# EAGLE design audio_spectrum (EAGLE 6.6.0)
AUTHOR: Joshua Adkins; REV: A; TITLE: AUDIO SPECTRUM MODULE

## Sheet 1 of 2
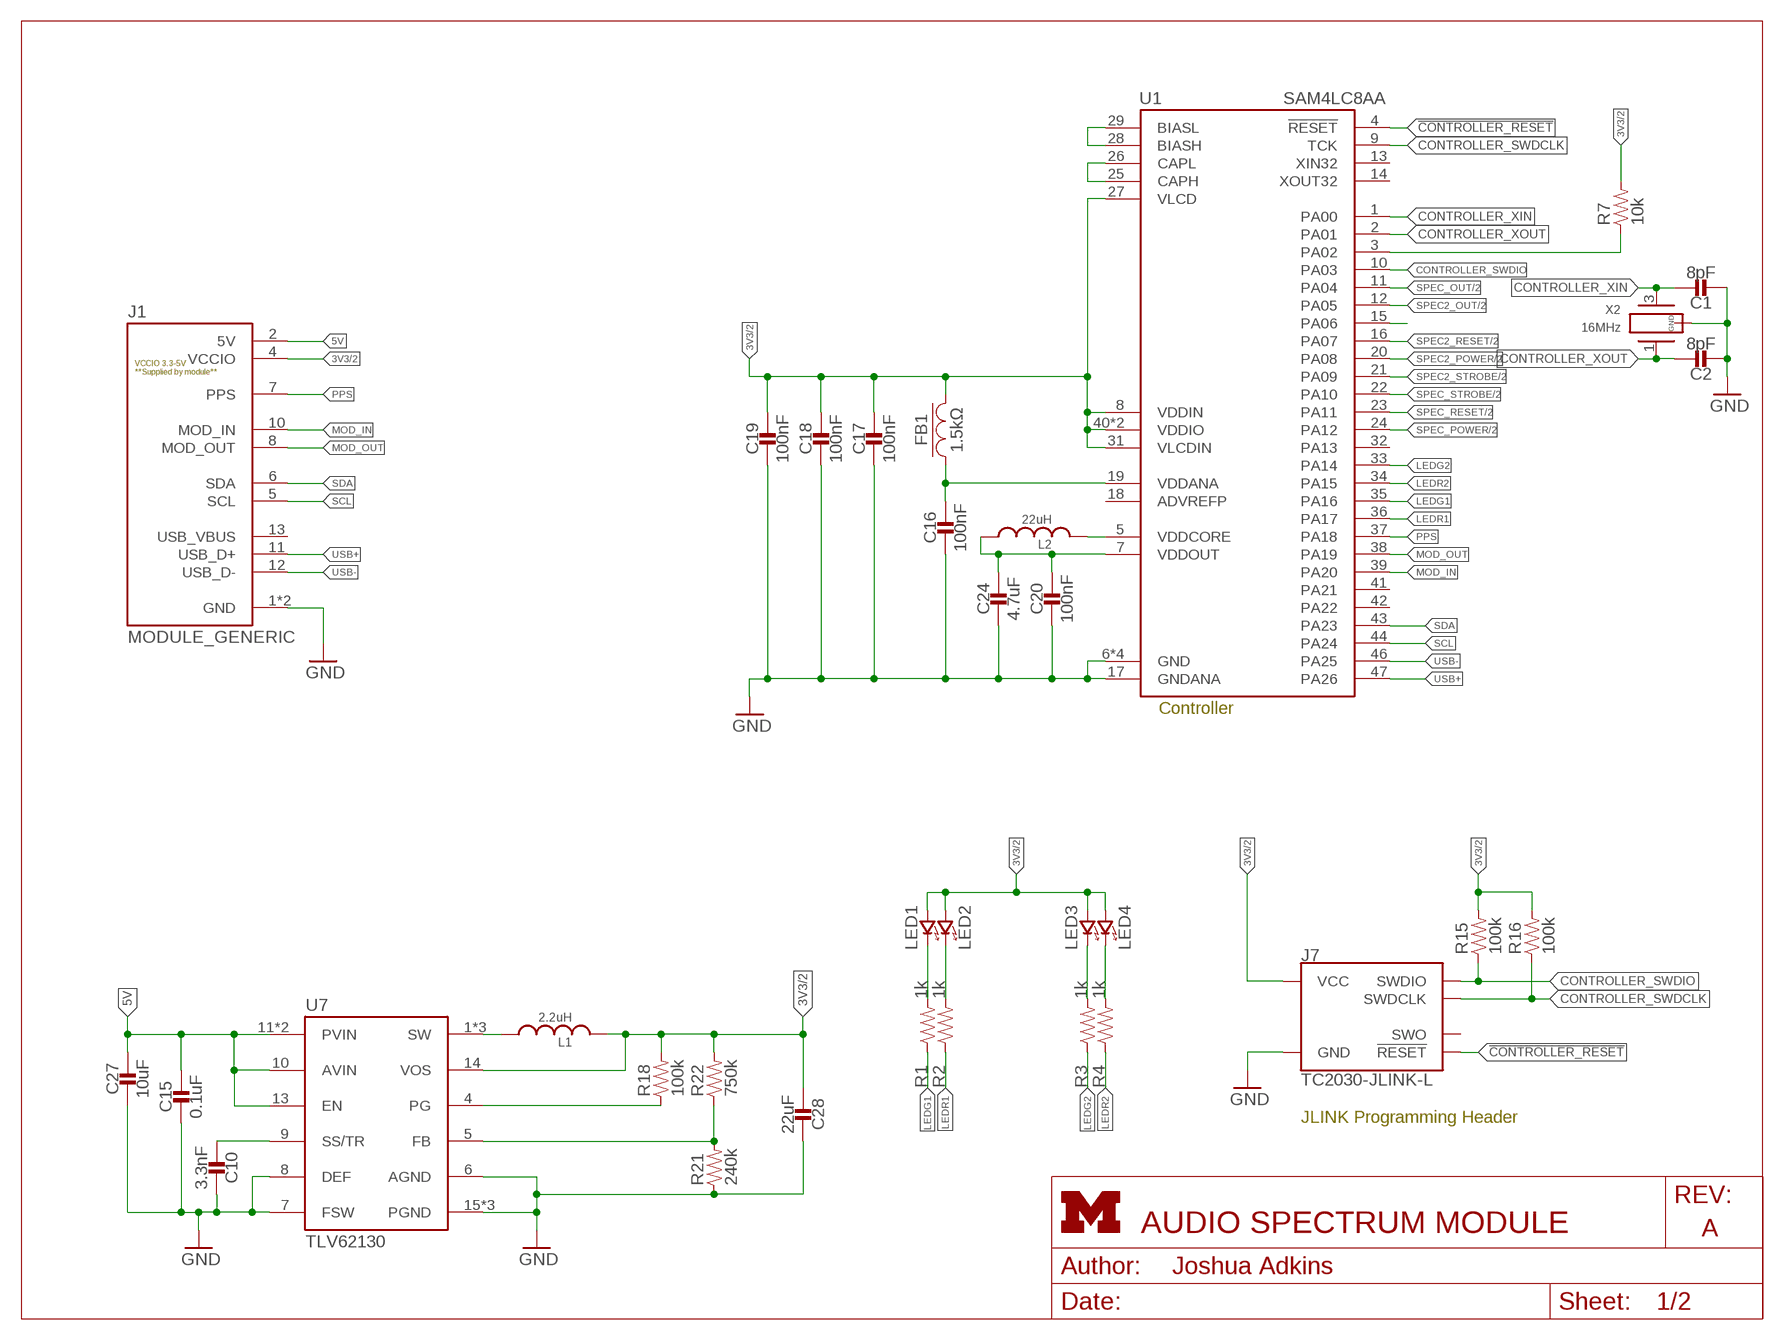
[diagram p0: schematic, sheet 1]
FRAME1 (LETTER_L_UMICH): HEIGHT: 8.5in; WIDTH: 11in

### Parts
C1  8pF  CAPACITOR0603_CAP  [0603_CAP]
C2  8pF  CAPACITOR0603_CAP  [0603_CAP]
C10  3.3nF  CAPACITOR0603_CAP  [0603_CAP]
C15  0.1uF  CAPACITOR0603_CAP  [0603_CAP]
C16  100nF  CAPACITOR0603_CAP  [0603_CAP]
C17  100nF  CAPACITOR0603_CAP  [0603_CAP]
C18  100nF  CAPACITOR0603_CAP  [0603_CAP]
C19  100nF  CAPACITOR0603_CAP  [0603_CAP]
C20  100nF  CAPACITOR0603_CAP  [0603_CAP]
C24  4.7uF  CAPACITOR0603_CAP  [0603_CAP]
C27  10uF  CAPACITOR0603_CAP  [0603_CAP]
C28  22uF  CAPACITOR0603_CAP  [0603_CAP]
FB1  1.5kΩ  FERRITE_BEAD0603  [0603_CAP]
J1  MODULE_GENERIC  [MODULE_GENERIC]
J7  TC2030-JLINK-L  [TC2030-IDC]
L1  2.2uH  INDUCTORIHL  [IHL-1212BZ-11]
L2  22uH  LHQ3NP  [1212]
LED1  LED0603  [LED-0603]
LED2  LED0603  [LED-0603]
LED3  LED0603  [LED-0603]
LED4  LED0603  [LED-0603]
R1  1k  RESISTOR0603_RES  [0603-RES]
R2  1k  RESISTOR0603_RES  [0603-RES]
R3  1k  RESISTOR0603_RES  [0603-RES]
R4  1k  RESISTOR0603_RES  [0603-RES]
R7  10k  RESISTOR0603_RES  [0603-RES]
R15  100k  RESISTOR0603_RES  [0603-RES]
R16  100k  RESISTOR0603_RES  [0603-RES]
R18  100k  RESISTOR0603_RES  [0603-RES]
R21  240k  RESISTOR0603_RES  [0603-RES]
R22  750k  RESISTOR0603_RES  [0603-RES]
U1  SAM4LC8AA  [QFN-48-7MM]
U7  TLV62130  [TQFN-16/3MM]
X2  16MHz  FH1600015  [FHXXX]

### Nets
3V3: C17.1 C18.1 C19.1 C28.2 FB1.2 J1.4(VCCIO) J7.1(VCC) L1.P$2 LED1.A(ANODE) LED2.A(ANODE) LED3.A(ANODE) LED4.A(ANODE) R7.2 R15.2 R16.2 R18.2 R22.2 U1.8(VDDIN) U1.27(VLCD) U1.31(VLCDIN) U1.40(VDDIO) U1.45(VDDIO) U7.14(VOS) ; also sheet 2
3VSWOUT: L1.P$1 U7.1(SW) U7.2(SW) U7.3(SW)
5V: C15.1 C27.1 J1.2(5V) U7.10(AVIN) U7.11(PVIN) U7.12(PVIN) U7.13(EN)
!CONTROLLER_RESET: J7.3(!RESET) U1.4(!RESET)
CONTROLLER_BUCK/LDO_N: R7.1 U1.3(PA02)
CONTROLLER_SWDCLK: J7.4(SWDCLK) R16.1 U1.9(TCK)
CONTROLLER_SWDIO: J7.2(SWDIO) R15.1 U1.10(PA03)
CONTROLLER_XIN: C1.1 U1.1(PA00) X2.3
CONTROLLER_XOUT: C2.1 U1.2(PA01) X2.1
GND: C1.2 C2.2 C10.1 C15.2 C16.2 C17.2 C18.2 C19.2 C20.2 C24.2 C27.2 C28.1 J1.1(GND) J1.14(GND) J7.5(GND) R21.1 U1.6(GND) U1.17(GNDANA) U1.30(GND) U1.48(GND) U1.THERMAL(GND) U7.6(AGND) U7.7(FSW) U7.8(DEF) U7.15(PGND) U7.16(PGND) U7.GND X2.2(GND) X2.4(GND) ; also sheet 2
LEDG1: R1.1 U1.35(PA16)
LEDG2: R3.1 U1.33(PA14)
LEDR1: R2.1 U1.36(PA17)
LEDR2: R4.1 U1.34(PA15)
MOD_IN: J1.10(MOD_IN) U1.39(PA20)
MOD_OUT: J1.8(MOD_OUT) U1.38(PA19)
N$21: LED1.C(CATHODE) R1.2
N$23: LED2.C(CATHODE) R2.2
N$25: LED4.C(CATHODE) R4.2
N$31: U1.15(PA06)
N$32: C16.1 FB1.1 U1.19(VDDANA)
N$33: LED3.C(CATHODE) R3.2
N$34: C10.2 U7.9(SS/TR)
N$36: R18.1 U7.4(PG)
N$37: R21.2 R22.1 U7.5(FB)
N$44: C20.1 C24.1 L2.P$1 U1.7(VDDOUT)
N$52: L2.P$2 U1.5(VDDCORE)
N$53: U1.28(BIASH) U1.29(BIASL)
N$54: U1.25(CAPH) U1.26(CAPL)
PPS: J1.7(PPS) U1.37(PA18)
SCL: J1.5(SCL) U1.44(PA24)
SDA: J1.6(SDA) U1.43(PA23)
SPEC2_OUT: U1.12(PA05) ; also sheet 2
SPEC2_POWER: U1.20(PA08) ; also sheet 2
SPEC2_RESET: U1.16(PA07) ; also sheet 2
SPEC2_STROBE: U1.21(PA09) ; also sheet 2
SPEC_OUT: U1.11(PA04) ; also sheet 2
SPEC_POWER: U1.24(PA12) ; also sheet 2
SPEC_RESET: U1.23(PA11) ; also sheet 2
SPEC_STROBE: U1.22(PA10) ; also sheet 2
USB+: J1.11(USB_D+) U1.47(PA26)
USB-: J1.12(USB_D-) U1.46(PA25)
Unconnected: J1.13(USB_VBUS) J7.6(SWO) U1.13(XIN32) U1.14(XOUT32) U1.18(ADVREFP) U1.32(PA13) U1.41(PA21) U1.42(PA22)

### Notes on the sheet
- Controller
- JLINK Programming Header

## Sheet 2 of 2
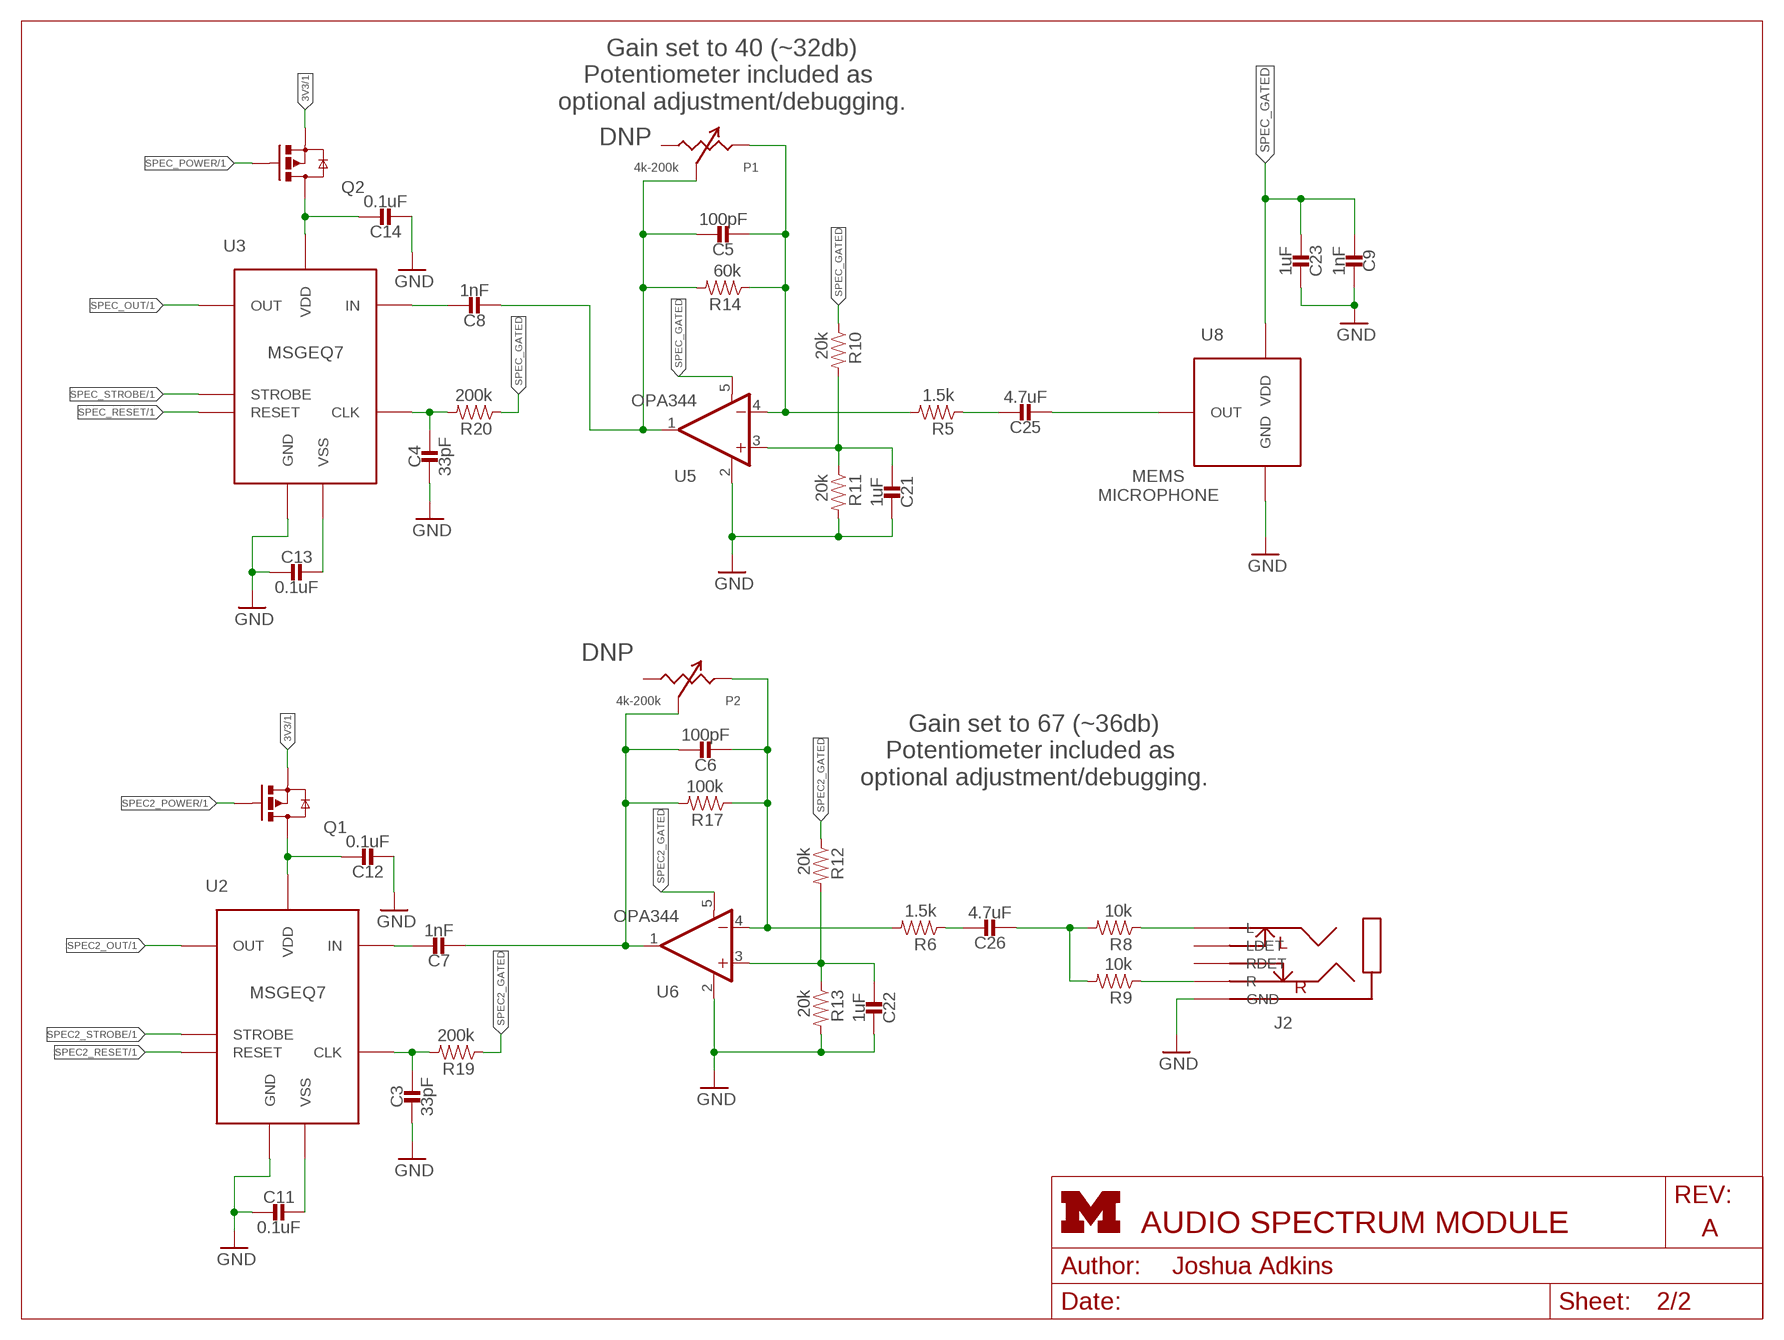
[diagram p1: schematic, sheet 2]
FRAME2 (LETTER_L_UMICH): HEIGHT: 8.5in; WIDTH: 11in

### Parts
C3  33pF  CAPACITOR0603_CAP  [0603_CAP]
C4  33pF  CAPACITOR0603_CAP  [0603_CAP]
C5  100pF  CAPACITOR0603_CAP  [0603_CAP]
C6  100pF  CAPACITOR0603_CAP  [0603_CAP]
C7  1nF  CAPACITOR0603_CAP  [0603_CAP]
C8  1nF  CAPACITOR0603_CAP  [0603_CAP]
C9  1nF  CAPACITOR0603_CAP  [0603_CAP]
C11  0.1uF  CAPACITOR0603_CAP  [0603_CAP]
C12  0.1uF  CAPACITOR0603_CAP  [0603_CAP]
C13  0.1uF  CAPACITOR0603_CAP  [0603_CAP]
C14  0.1uF  CAPACITOR0603_CAP  [0603_CAP]
C21  1uF  CAPACITOR0603_CAP  [0603_CAP]
C22  1uF  CAPACITOR0603_CAP  [0603_CAP]
C23  1uF  CAPACITOR0603_CAP  [0603_CAP]
C25  4.7uF  CAPACITOR0603_CAP  [0603_CAP]
C26  4.7uF  CAPACITOR0603_CAP  [0603_CAP]
J2  AUDIO-JACK-VERTICAL  [AUDIO-JACK-VERTICAL]
P1  4k-200k  POTTC33X  [TC33X-2]
P2  4k-200k  POTTC33X  [TC33X-2]
Q1  NX3008PBK  [SOT23-3]
Q2  NX3008PBK  [SOT23-3]
R5  1.5k  RESISTOR0603_RES  [0603-RES]
R6  1.5k  RESISTOR0603_RES  [0603-RES]
R8  10k  RESISTOR0603_RES  [0603-RES]
R9  10k  RESISTOR0603_RES  [0603-RES]
R10  20k  RESISTOR0603_RES  [0603-RES]
R11  20k  RESISTOR0603_RES  [0603-RES]
R12  20k  RESISTOR0603_RES  [0603-RES]
R13  20k  RESISTOR0603_RES  [0603-RES]
R14  60k  RESISTOR0603_RES  [0603-RES]
R17  100k  RESISTOR0603_RES  [0603-RES]
R19  200k  RESISTOR0603_RES  [0603-RES]
R20  200k  RESISTOR0603_RES  [0603-RES]
U2  MSGEQ7  [DIP-8]
U3  MSGEQ7  [DIP-8]
U5  OPA344  [SOT23-5]
U6  OPA344  [SOT23-5]
U8  MP23AB02B  [MP23AB02B]

### Nets
3V3: Q1.2(S) Q2.2(S) ; also sheet 1
GND: C3.2 C4.2 C9.1 C11.2 C12.2 C13.2 C14.2 C21.1 C22.1 C23.1 J2.5(GND) R11.2 R13.2 U2.6(GND) U3.6(GND) U5.2(V-) U6.2(V-) U8.3(GND) ; also sheet 1
N$1: C11.1 U2.2(VSS)
N$2: C3.1 R19.2 U2.8(CLK)
N$3: C7.1 U2.5(IN)
N$4: C6.1 C7.2 P2.3(W) R17.2 U6.1(OUT)
N$5: C13.1 U3.2(VSS)
N$6: C4.1 R20.2 U3.8(CLK)
N$7: C8.1 U3.5(IN)
N$8: C5.1 C8.2 P1.3(W) R14.2 U5.1(OUT)
N$9: C21.2 R10.2 R11.1 U5.3(+IN)
N$10: C26.2 R8.2 R9.2
N$11: C22.2 R12.2 R13.1 U6.3(+IN)
N$12: C5.2 P1.2(CW) R5.2 R14.1 U5.4(-IN)
N$13: C25.1 R5.1
N$14: C6.2 P2.2(CW) R6.2 R17.1 U6.4(-IN)
N$15: C26.1 R6.1
N$16: J2.1(R) R9.1
N$17: J2.4(L) R8.1
N$18: C25.2 U8.1(OUT)
SPEC2_GATED: C12.1 Q1.3(D) R12.1 R19.1 U2.1(VDD) U6.5(V+)
SPEC2_OUT: U2.3(OUT) ; also sheet 1
SPEC2_POWER: Q1.1(G) ; also sheet 1
SPEC2_RESET: U2.7(RESET) ; also sheet 1
SPEC2_STROBE: U2.4(STROBE) ; also sheet 1
SPEC_GATED: C9.2 C14.1 C23.2 Q2.3(D) R10.1 R20.1 U3.1(VDD) U5.5(V+) U8.2(VDD)
SPEC_OUT: U3.3(OUT) ; also sheet 1
SPEC_POWER: Q2.1(G) ; also sheet 1
SPEC_RESET: U3.7(RESET) ; also sheet 1
SPEC_STROBE: U3.4(STROBE) ; also sheet 1
Unconnected: J2.2(RDET) J2.3(LDET) P1.1(CCW) P2.1(CCW)

### Notes on the sheet
- Gain set to 40 (~32db)
  Potentiometer included as 
  optional adjustment/debugging.
- DNP
- DNP
- Gain set to 67 (~36db)
  Potentiometer included as 
  optional adjustment/debugging.

## Library data of the parts
C1 C2 = passives:CAPACITOR: 0402 Capacitor; DIGIKEY: 490-8230-1-ND
C3-C15 C21-C23 C25-C28 = passives:CAPACITOR: 0402 Capacitor
C16-C20 = passives:CAPACITOR: 0402 Capacitor; DIGIKEY: 490-10777-1-ND
C24 = passives:CAPACITOR: 0402 Capacitor; DIGIKEY: 490-13252-1-ND
FB1 = passives:FERRITE_BEAD; DIGIKEY: 490-5216-1-ND
J1 = signpost:MODULE_GENERIC: Module header and PCB guildes for signposts; DIGIKEY: S9170-ND
J2 = connector:AUDIO-JACK-VERTICAL: A vertical audio jack; MOUSER: 806-STX-3790-5N
J7 = connector:TC2030-JLINK
L1 = passives:INDUCTOR: A very specific inductor; DIGIKEY: 541-1322-1-ND
L2 = signpost:LHQ3NP: LHQ3NP Inductor; DIGIKEY: 490-5350-1-ND
LED1-LED4 = leds:LED: LED
P1 P2 = pots:POT: Potentiometer; DIGIKEY: TC33X-2-204ECT-ND
Q1 Q2 = fets:NX3008PBK: MOSFET - P Channel; DIGIKEY: 568-10499-1-ND; MOUSER: 771-NX3008PBK,215; NEWARK: 74T4665
R1-R4 R7 = passives:RESISTOR: Resistor Basic schematic elements and footprints for 0603, 1206, and PTH resistors.; DIGIKEY: 1276-3431-1-ND
R5 R6 R8-R14 R17-R22 = passives:RESISTOR: Resistor Basic schematic elements and footprints for 0603, 1206, and PTH resistors.
R15 R16 = passives:RESISTOR: Resistor Basic schematic elements and footprints for 0603, 1206, and PTH resistors.; DIGIKEY: 1276-3432-1-ND
U1 = chips:SAM4LC8AA: Atmel SAM4L microcontroller. ARM Cortex M4 with 512 KB Flash and 64 KB RAM; DIGIKEY: ATSAM4LC8AA-MU-ND
U2 U3 = chips:MSGEQ7: A CMOS spectrum analyzer; DIGIKEY: 1568-1335-ND
U5 U6 = SparkFun-AnalogIC:OPA344: Single gate rail-to-rail output op-amp. Inputs extend 300mV past rails.
U7 = chips:TLV62130: High Efficient 3A switching step-down regulator. 1V-5V out, 4V-17V in.; DIGIKEY: 296-35978-1-ND
U8 = chips:MP23AB02B: A pretty normal mems microphone; DIGIKEY: 497-14947-1-ND
X2 = crystals:FH1600015: Pericom Type FH 16 MHz 2.5 x 2.0 mm; DIGIKEY: FH1600015CT-ND

## Board
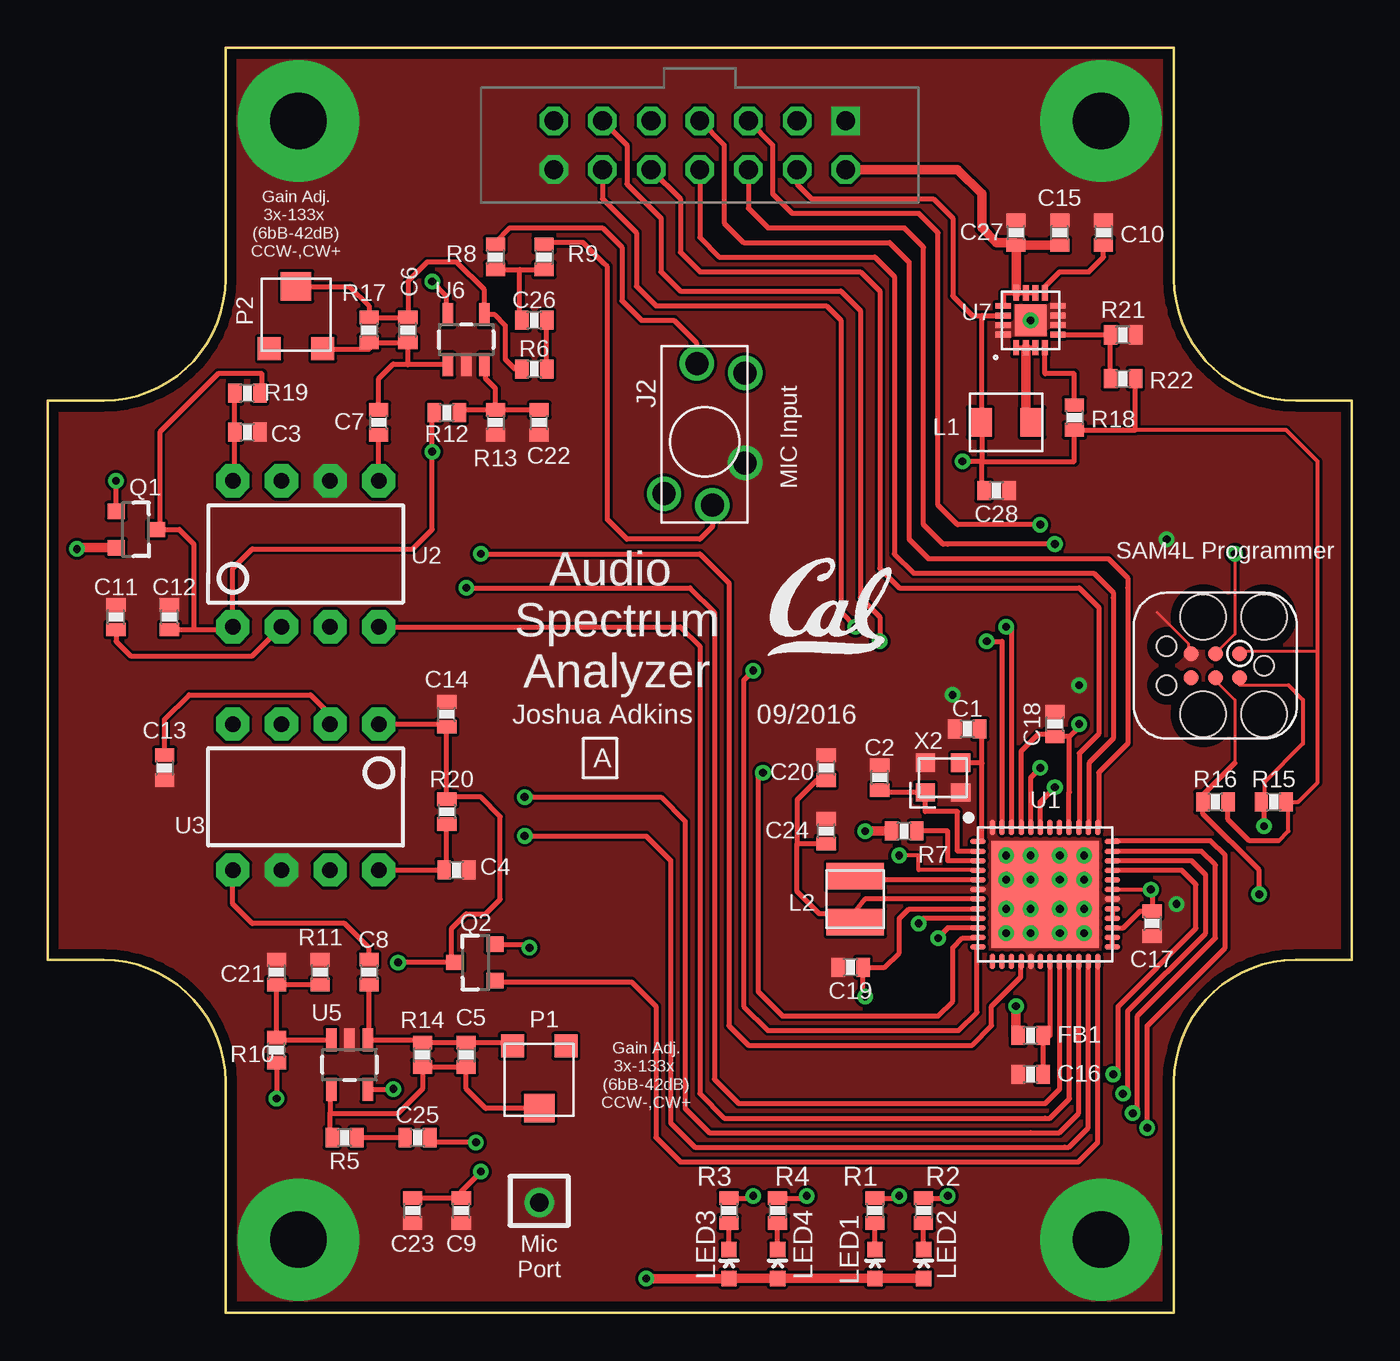
[diagram p2: board, top side]
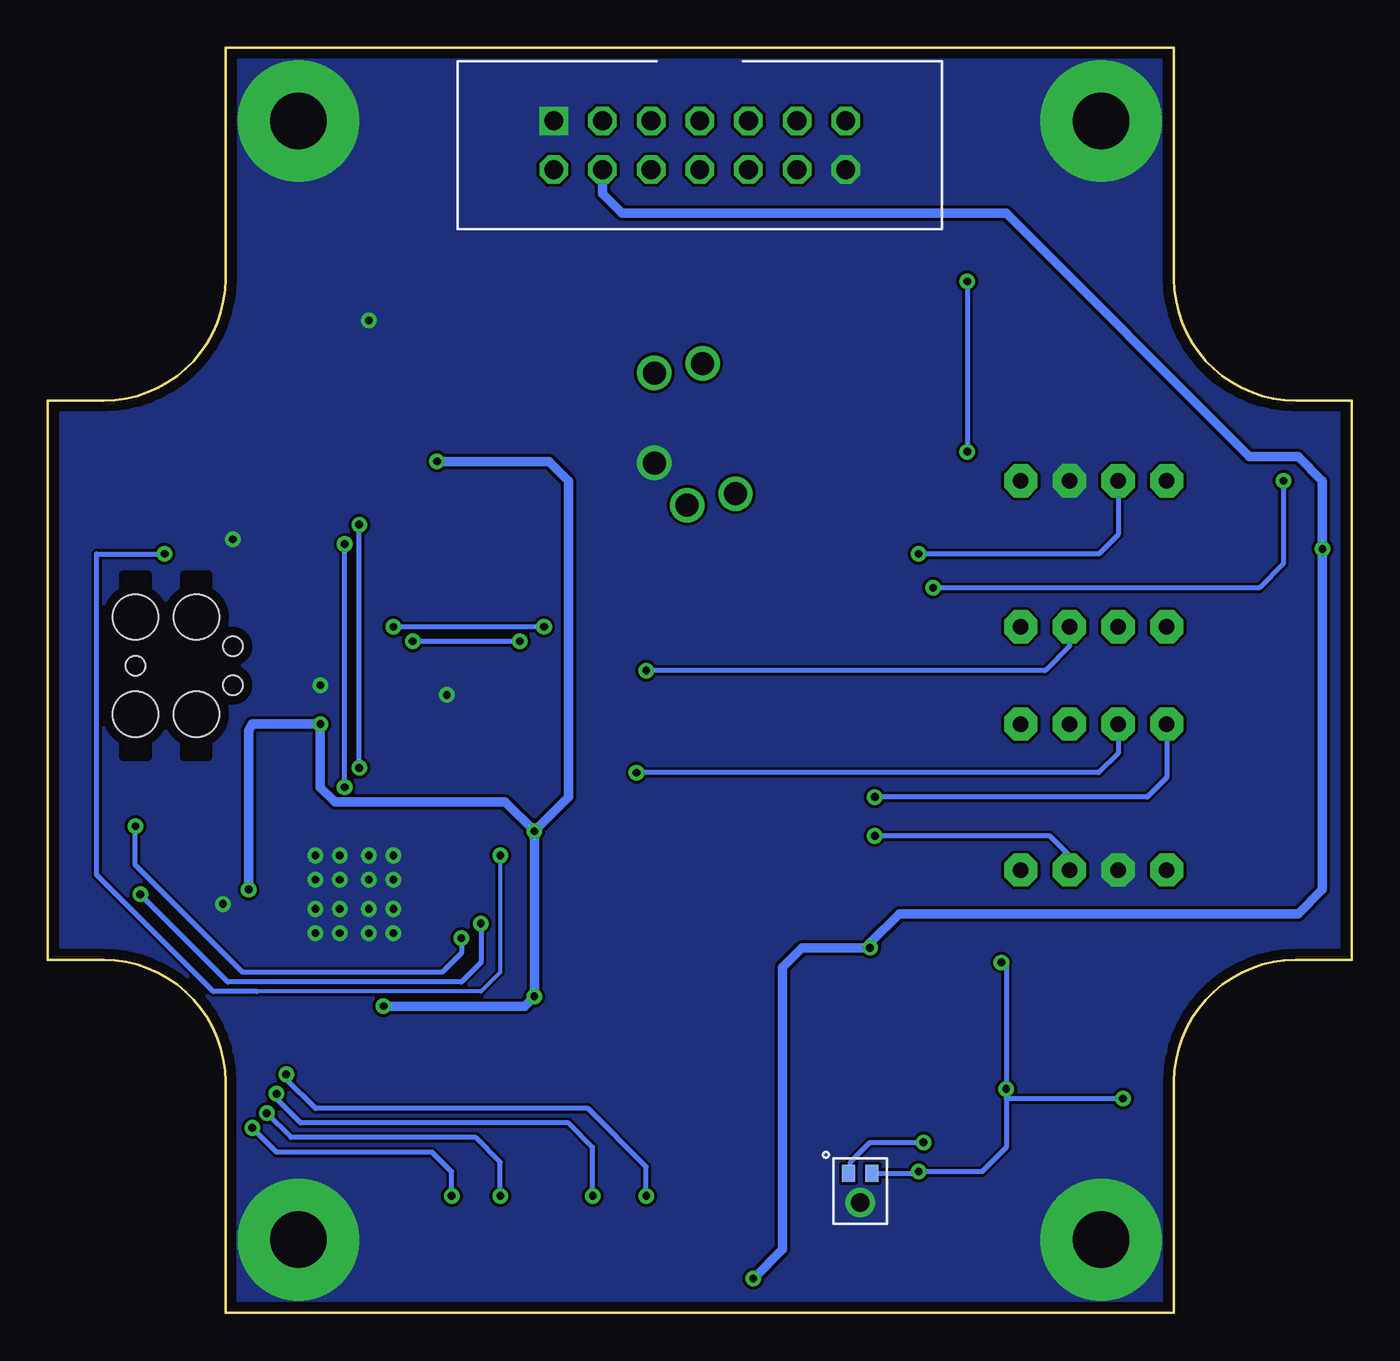
[diagram p3: board, bottom side, seen from below]

Size 68.07 x 66.04 mm. Coordinates in mm from the lower left corner, seen from the top.
Outline: 9.27,66.04 58.8,66.04 58.8,53.98 arc90 65.15,47.62 68.07,47.62 68.07,18.41 65.15,18.41 arc90 58.8,12.07 58.8,0 9.27,0 9.27,12.07 arc90 2.92,18.41 0,18.41 0,47.62 2.92,47.62 arc90 9.27,53.98 9.27,66.04
Copper layers (1*16): Top 0.0178mm / dielectric 59mil / Bottom 0.0178mm
Design rules "quickturn_co_kr_1oz": minimum track width 4mil, minimum drill 0.200659375mm, track to track 4mil, track to pad 4mil, pad to pad 4mil, via to via 4mil, smd to smd 4mil, copper to edge 20mil, drill to drill 16mil, minimum pad ring 8mil, minimum via ring 8mil, stop-mask expansion 3mil, vias tented up to drill 50mil, thermal gap 10mil

### Footprints (pad centres in the part's own frame; a part is rotated, then mirrored left to right if it is on the bottom)
0603_CAP = smd 0.7 x 1: 1 -0.65,0; 2 0.65,0
MODULE_GENERIC = drill 0.991 square: 1 7.62,29.21 | drill 0.991 octagon: 2 7.62,26.67; 3 5.08,29.21; 4 5.08,26.67; 5 2.54,29.21; 6 2.54,26.67; 7 0,29.21; 8 0,26.67; 9 -2.54,29.21; 10 -2.54,26.67; 11 -5.08,29.21; 12 -5.08,26.67; 13 -7.62,29.21; 14 -7.62,26.67
AUDIO-JACK-VERTICAL = drill 1.2: 1 -3.3,-0.4; 2 -2.7,2.12; 3 3.6,-2.12; 4 4.1,0.4; 5 -1.1,-2.12
TC2030-IDC = smd 0.787 x 0.787: 1 -1.27,-0.635; 2 -1.27,0.635; 3 0,-0.635; 4 0,0.635; 5 1.27,-0.635; 6 1.27,0.635 | hole 2.375: -2.54,2.54; 0.635,2.54; 0.635,-2.54; -2.54,-2.54 | hole 1.016: -2.54,0; 2.54,1.016; 2.54,-1.016
IHL-1212BZ-11 = smd 1.2 x 1.5: P$1 -1.35,0; P$2 1.35,0
1212 = smd 1.4 x 3: P$1 -1.2,0; P$2 1.2,0
LED-0603 = smd 0.8 x 0.8: A 0,-0.75; C 0,0.75
TC33X-2 = smd 1.2 x 1.2: 1 -1.4,-2.5; 3 1.4,-2.5 | smd 1.6 x 1.5: 2 0,0.75
SOT23-3 = smd 0.8 x 0.9: 1 -0.95,-1; 2 0.95,-1; 3 0,1.1
0603-RES = smd 0.7 x 1: 1 -0.65,0; 2 0.65,0
QFN-48-7MM = smd 0.8 x 0.28: 1 -3.5,2.75; 2 -3.5,2.25; 3 -3.5,1.75; 4 -3.5,1.25; 5 -3.5,0.75; 6 -3.5,0.25; 7 -3.5,-0.25; 8 -3.5,-0.75; 9 -3.5,-1.25; 10 -3.5,-1.75; 11 -3.5,-2.25; 12 -3.5,-2.75; 25 3.5,-2.75; 26 3.5,-2.25; 27 3.5,-1.75; 28 3.5,-1.25; 29 3.5,-0.75; 30 3.5,-0.25; 31 3.5,0.25; 32 3.5,0.75; 33 3.5,1.25; 34 3.5,1.75; 35 3.5,2.25; 36 3.5,2.75 | smd 0.28 x 0.8: 13 -2.75,-3.5; 14 -2.25,-3.5; 15 -1.75,-3.5; 16 -1.25,-3.5; 17 -0.75,-3.5; 18 -0.25,-3.5; 19 0.25,-3.5; 20 0.75,-3.5; 21 1.25,-3.5; 22 1.75,-3.5; 23 2.25,-3.5; 24 2.75,-3.5; 37 2.75,3.5; 38 2.25,3.5; 39 1.75,3.5; 40 1.25,3.5; 41 0.75,3.5; 42 0.25,3.5; 43 -0.25,3.5; 44 -0.75,3.5; 45 -1.25,3.5; 46 -1.75,3.5; 47 -2.25,3.5; 48 -2.75,3.5 | smd 5.6 x 5.6: THERMAL 0,0
DIP-8 = drill 0.813 pad 1.727 octagon: 1 -3.81,-3.81; 2 -1.27,-3.81; 3 1.27,-3.81; 4 3.81,-3.81; 5 3.81,3.81; 6 1.27,3.81; 7 -1.27,3.81; 8 -3.81,3.81
SOT23-5 = smd 0.55 x 1.2: 1 -0.95,-1.3; 2 0,-1.3; 3 0.95,-1.3; 4 0.95,1.3; 5 -0.95,1.3
TQFN-16/3MM = smd 0.3 x 0.8: 1 -0.75,-1.43; 2 -0.25,-1.43; 3 0.25,-1.43; 4 0.75,-1.43; 9 0.75,1.43; 10 0.25,1.43; 11 -0.25,1.43; 12 -0.75,1.43 | smd 0.8 x 0.3: 5 1.43,-0.75; 6 1.43,-0.25; 7 1.43,0.25; 8 1.43,0.75; 13 -1.43,0.75; 14 -1.43,0.25; 15 -1.43,-0.25; 16 -1.43,-0.75 | smd 1.63 x 1.63: GND 0,0
MP23AB02B = smd 0.68 x 0.9: 1 -0.61,0.925; 2 0.61,0.925 | drill 0.95 pad 1.55: 3 0,-0.595
FHXXX = smd 1 x 0.95: 1 -0.925,-0.775; 2 0.925,-0.775; 3 0.925,0.775; 4 -0.925,0.775

### Placement (x,y rotation side)
C1  48.01,30.48 180 top
C2  43.43,27.94 90 top
C3  10.41,45.97 0 top
C4  21.34,23.11 0 top
C5  21.84,13.46 270 top
C6  18.8,51.31 90 top
C7  17.27,46.48 90 top
C8  16.76,17.78 270 top
C9  21.59,5.33 90 top
C10  55.12,56.39 270 top
C11  3.56,36.32 90 top
C12  6.35,36.32 90 top
C13  6.1,28.45 270 top
C14  20.83,31.24 90 top
C15  52.83,56.39 90 top
C16  51.31,12.45 180 top
C17  57.66,20.32 270 top
C18  52.58,30.73 90 top
C19  41.91,18.03 180 top
C20  40.64,28.45 90 top
C21  11.94,17.78 270 top
C22  25.65,46.48 90 top
C23  19.05,5.33 90 top
C24  40.64,25.15 90 top
C25  19.3,9.14 0 top
C26  25.4,51.82 180 top
C27  50.55,56.39 90 top
C28  49.53,42.93 180 top
FB1  51.31,14.48 180 top
J1  34.04,33.02 0 top
J2  34.29,45.47 90 top
J7  60.96,33.78 180 top
L1  50.04,46.48 180 top
L2  42.16,21.59 90 top
LED1  43.18,2.54 0 top
LED2  45.72,2.54 0 top
LED3  35.56,2.54 0 top
LED4  38.1,2.54 0 top
P1  25.65,11.43 180 top
P2  12.95,52.83 0 top
Q1  4.57,40.89 270 top
Q2  22.35,18.29 90 top
R1  43.18,5.33 270 top
R2  45.72,5.33 270 top
R3  35.56,5.33 270 top
R4  38.1,5.33 270 top
R5  15.49,9.14 180 top
R6  25.4,49.28 180 top
R7  44.7,25.15 180 top
R8  23.37,55.12 270 top
R9  25.91,55.12 270 top
R10  11.94,13.72 90 top
R11  14.22,17.78 90 top
R12  20.83,46.99 0 top
R13  23.37,46.48 270 top
R14  19.56,13.46 90 top
R15  64.01,26.67 0 top
R16  60.96,26.67 0 top
R17  16.76,51.31 270 top
R18  53.59,46.74 270 top
R19  10.41,48.01 180 top
R20  20.83,26.16 270 top
R21  56.13,51.05 180 top
R22  56.13,48.77 0 top
U1  52.07,21.84 0 top
U2  13.46,39.62 0 top
U3  13.46,26.92 180 top
U5  15.75,12.95 180 top
U6  21.84,50.8 0 top
U7  51.31,51.82 0 top
U8  25.65,6.35 0 bottom
U$2  [UCB_CAL_200MIL]  37.59,34.29 0 top
X2  46.74,27.94 0 top

### Tracks (layer width: path | path; a pad name or v marks a point on that pad's centre or on a via)
3V3  (via drill 0.41)
  Top 0.152: 62.23,34.54 66.29,34.54
  Top 0.203: 56.13,46.09 64.66,46.09 66.29,44.45 66.29,34.54 66.29,27.69 65.28,26.67 64.77,26.67 | 64.26,24.64 64.77,25.15 64.77,26.67 | R15.2 64.77,26.67 | J7.1 62.23,34.54 | U1.31 v57.59,22.09
  Top 0.254: 48.77,46.48 48.77,52.07 | 48.77,52.07 U7.14 | 48.69,46.59 L1.P$2 48.77,46.48 | 48.77,44.45 53.59,44.45 R18.2 56.13,46.09 56.78,46.09 R22.2 | J1.4 39.12,58.93 39.88,58.17 46.23,58.17 47.24,57.15 47.24,53.09 48.26,52.07 48.77,52.07 | 1.52,39.94 v1.52,39.88 | Q2.2 24.96,19.24 v25.15,19.05 | C28.2 48.77,42.93 48.77,44.45 | U1.8 44.96,21.08 44.45,20.57 44.45,18.8 43.69,18.03 C19.1 42.56,16.51 v42.67,16.51 | U1.45 50.82,29.32 51.72,30.23 52.58,30.23 C18.1 53.34,30.08 | U1.40 53.32,27.18 53.34,27.18 53.34,30.08 | 53.34,30.08 53.85,30.59 v53.85,30.73 | FB1.2 50.55,14.48 | 48.77,44.45 v47.75,44.45 | 48.77,46.48 48.77,44.45 | 35.55,1.78 LED3.A | U1.27 56.16,20.09 57.04,20.97 C17.1 57.66,22.02 v57.59,22.09 | 64.26,24.64 62.74,24.64 61.61,25.77 R16.2
  Top 0.508: Q1.2 1.52,39.94 | R7.2 v42.67,25.15 | 50.55,14.48 v50.55,16 | LED2.A LED1.A LED4.A LED3.A | v31.24,1.78 35.55,1.78
  Bottom 0.508: J1.4 39.12,58.42 38.1,57.4 18.03,57.4 5.33,44.7 2.79,44.7 1.52,43.43 v1.52,39.88 1.52,22.1 2.79,20.83 23.62,20.83 25.15,19.3 v25.15,19.05 28.7,19.05 29.72,18.03 29.72,3.3 v31.24,1.78 | v42.67,25.15 44.2,26.67 53.09,26.67 53.85,27.43 v53.85,30.73 57.4,30.73 57.59,30.41 v57.59,22.09 | v42.67,25.15 v42.67,16.51 43.18,16 v50.55,16 | v47.75,44.45 41.91,44.45 40.89,43.43 40.89,26.92 v42.67,25.15
3VSWOUT
  Top 0.254: U7.1 U7.2 U7.3
  Top 0.508: L1.P$1 51.06,46.48 U7.2
5V
  Top 0.254: U7.10 U7.11 U7.12 49.88,53.25 U7.13
  Top 0.508: C15.1 C27.1 | C27.1 U7.12 | J1.2 47.5,59.69 48.77,58.42 48.77,56.64 49.53,55.88 50.55,55.88 C27.1
!CONTROLLER_RESET  (via drill 0.41)
  Top 0.152: v61.98,39.62 61.98,35.43 J7.3
  Top 0.203: U1.4 48.57,23.11 45.47,23.11 45.47,23.88 v44.45,23.88
  Bottom 0.203: v44.45,23.88 44.45,18.03 44.45,17.78 45.47,16.76 57.15,16.76
  Bottom 0.254: 57.15,16.76 59.44,16.76 65.53,22.86 65.53,39.62 v61.98,39.62
CONTROLLER_BUCK/LDO_N
  Top 0.254: U1.3 46.99,23.59 46.99,25.15 R7.1
CONTROLLER_SWDCLK  (via drill 0.41)
  Top 0.152: 60.96,33.02 61.98,32 61.98,28.7
  Top 0.203: J7.4 60.96,33.02
  Top 0.254: U1.9 45.72,20.59 v45.47,20.32 | v63.25,21.84 63.25,23.11 60.31,26.05 R16.1 60.31,27.04 61.98,28.7
  Bottom 0.254: v45.47,20.32 45.47,18.29 46.48,17.27 58.67,17.27 v63.25,21.84
CONTROLLER_SWDIO  (via drill 0.41)
  Top 0.152: J7.2 62.23,32.77 64.77,32.77
  Top 0.203: 64.77,32.77 65.53,32 65.53,29.72 63.5,27.69 63.5,26.67 R15.1
  Top 0.254: U1.10 46.99,20.09 v46.48,19.56 | v63.5,25.4 63.5,26.53 R15.1
  Bottom 0.254: v46.48,19.56 46.48,18.8 47.5,17.78 57.91,17.78 63.5,23.37 v63.5,25.4
CONTROLLER_XIN
  Top 0.254: U1.1 48.77,24.59 48.77,28.7 | 48.77,28.7 X2.3 | 48.77,28.7 48.77,30.48 C1.1
CONTROLLER_XOUT
  Top 0.254: U1.2 47.5,24.09 47.5,26.16 45.81,26.16 X2.1 43.43,27.16 C2.1
GND  (via drill 0.41, 2.95 pad 6.35)
  Top 0.152: 59.56,34.42 59.56,34.93 57.91,36.58
  Top 0.254: J7.5 59.56,34.42
  other vias: 51.31,51.82 53.85,32.77 47.24,32.26 58.42,40.39 50.04,19.81 50.04,23.88 50.04,22.61 50.04,21.08 51.31,19.81 52.83,19.81 54.1,19.81 54.1,21.08 54.1,22.61 54.1,23.88 52.83,23.88 51.31,23.88 51.31,22.61 51.31,21.08 52.83,21.08 52.83,22.61 13.08,62.23 54.99,62.23 54.99,3.81 13.08,3.81 58.93,21.34
  pour Bottom (isolate 0.152, no thermals): -2.29,74.42 79.25,74.42 79.25,-7.37 -2.29,-7.37
  pour Top (isolate 0.152, no thermals): -2.29,74.93 80.26,74.93 80.26,-10.16 -2.29,-10.16
LEDG1  (via drill 0.41)
  Top 0.254: R1.1 44.34,5.98 v44.45,6.1 | v56.64,10.41 56.9,10.67 56.9,15.49 60.96,19.56 60.96,23.37 60.23,24.09 U1.35
  Bottom 0.254: v44.45,6.1 44.45,7.87 45.72,9.14 55.37,9.14 v56.64,10.41
LEDG2  (via drill 0.41)
  Top 0.254: R3.1 36.72,5.98 v36.83,6.1 | v55.63,12.45 55.88,12.7 55.88,16 59.94,20.07 59.94,22.35 59.2,23.09 U1.33
  Bottom 0.254: v36.83,6.1 36.83,7.62 39.88,10.67 54.1,10.67 55.63,12.19 v55.63,12.45
LEDR1  (via drill 0.41)
  Top 0.254: R2.1 46.88,5.98 v46.99,6.1 | v57.4,9.65 57.4,14.99 61.47,19.05 61.47,23.88 60.71,24.64 55.61,24.64 U1.36
  Bottom 0.254: v46.99,6.1 46.99,7.37 48.01,8.38 56.13,8.38 v57.4,9.65
LEDR2  (via drill 0.41)
  Top 0.254: R4.1 39.51,5.98 v39.62,6.1 | v56.13,11.43 56.39,11.68 56.39,15.75 60.45,19.81 60.45,22.86 59.72,23.59 U1.34
  Bottom 0.254: v39.62,6.1 39.62,8.64 40.89,9.91 54.86,9.91 56.13,11.18 v56.13,11.43
MOD_IN
  Top 0.254: J1.10 33.02,58.17 33.02,55.37 34.04,54.36 42.42,54.36 43.43,53.34 43.43,38.86 44.45,37.85 53.85,37.85 54.86,36.83 54.86,30.23 53.85,29.21 53.85,25.34 U1.39
MOD_OUT
  Top 0.254: J1.8 34.04,56.13 35.05,55.12 43.18,55.12 44.2,54.1 44.2,39.62 45.21,38.61 54.61,38.61 55.63,37.59 55.63,37.34 55.63,29.97 54.36,28.7 54.36,25.34 U1.38
N$1
  Top 0.254: C11.1 3.56,35.05 4.32,34.29 10.67,34.29 U2.2
N$2
  Top 0.254: U2.8 9.76,43.43 C3.1 R19.2
N$3
  Top 0.254: U2.5 C7.1
N$4
  Top 0.254: P2.3 14.86,50.29 16.76,50.29 R17.2 C6.1 18.8,49.53 | U6.1 18.8,49.5 18.8,49.53 | C7.2 17.27,48.77 18.03,49.53 18.8,49.53
N$5
  Top 0.254: C13.1 6.1,30.99 7.37,32.26 13.72,32.26 14.73,31.24 U3.2
N$6
  Top 0.254: U3.8 C4.1 20.83,23.11 R20.2
N$7
  Top 0.254: C8.1 16.76,19.05 15.49,20.32 10.67,20.32 9.65,21.34 U3.5
N$8
  Top 0.254: P1.3 24.25,14.11 C5.1 R14.2 19.56,14.25 U5.1 16.76,14.25 C8.2
N$9
  Top 0.254: R11.1 C21.2 R10.2 11.94,14.22 14.8,14.22 U5.3
N$10
  Top 0.254: R8.2 24.64,54.47 | 24.64,54.47 R9.2 | C26.2 24.64,51.82 24.64,54.47
N$11
  Top 0.254: C22.2 R13.1 | 22.79,49.28 U6.3 22.86,49.43 22.86,48.77 23.37,48.26 R13.1 | R13.1 21.48,47.13 R12.2
N$12
  Top 0.254: P1.2 22.86,10.67 22.86,10.68 21.84,11.7 C5.2 R14.1 19.56,11.68 18.29,10.41 14.73,10.41 | U5.4 14.73,11.65 14.73,10.41 | R5.2 14.73,9.14 14.73,10.41
N$13
  Top 0.254: R5.1 C25.1
N$14
  Top 0.254: R6.2 24.38,49.28 23.88,49.78 23.88,51.56 23.34,52.1 U6.4 22.79,53.41 21.34,54.86 19.81,54.86 18.8,53.85 C6.2 R17.1 16.76,52.58 15.76,53.58 P2.2
N$15
  Top 0.254: R6.1 C26.1
N$16
  Top 0.254: R9.1 26.02,55.88 27.94,55.88 28.57,55.24 29.04,54.78 29.21,54.61 29.21,41.4 30.23,40.39 34.04,40.39 34.69,41.04 J2.1
N$17
  Top 0.254: R8.1 23.37,55.88 24.13,56.64 28.96,56.64 29.97,55.63 29.97,52.83 30.99,51.82 32.69,51.82 33.7,50.8 33.89,50.61 J2.4
N$18  (via drill 0.41)
  Top 0.254: v22.35,8.89 19.95,8.89 C25.2
  Bottom 0.254: U8.1 26.16,7.27 26.16,7.87 25.15,8.89 v22.35,8.89
N$21
  Top 0.254: LED1.C R1.2
N$23
  Top 0.254: LED2.C R2.2
N$25
  Top 0.254: LED4.C R4.2
N$32
  Top 0.254: U1.19 52.32,14.48 FB1.1 C16.1
N$33
  Top 0.254: LED3.C R3.2
N$34
  Top 0.254: U7.9 52.07,53.59 52.83,54.36 54.36,54.36 55.12,55.12 C10.2
N$36
  Top 0.254: R18.1 53.59,49.02 52.06,49.02 U7.4
N$37
  Top 0.254: R22.1 R21.2 55.48,51.07 U7.5
N$44
  Top 0.254: U1.7 42.67,21.59 42.16,20.97 42.16,20.83 | 42.16,20.83 L2.P$1 | C20.1 40.13,27.8 39.12,26.78 39.12,24.5 | 39.12,24.5 C24.1 | 42.16,20.83 40.27,20.83 39.12,21.99 39.12,24.5
N$52
  Top 0.254: U1.5 42.16,22.59 L2.P$2
N$53
  Top 0.254: U1.29 U1.28
N$54
  Top 0.254: U1.25 U1.26
PPS
  Top 0.254: J1.7 35.31,60.96 35.31,56.9 36.32,55.88 43.94,55.88 44.96,54.86 44.96,40.39 45.97,39.37 55.37,39.37 56.39,38.35 56.39,37.85 56.39,29.72 54.86,28.19 54.86,25.34 U1.37
SCL  (via drill 0.41)
  Top 0.254: J1.5 37.85,60.96 37.85,58.42 38.86,57.4 45.47,57.4 46.48,56.39 46.48,42.16 47.5,41.15 v51.82,41.15 | U1.44 51.32,27.94 v51.82,28.45
  Bottom 0.254: v51.82,28.45 v51.82,41.15
SDA  (via drill 0.41)
  Top 0.254: J1.6 36.58,57.66 37.59,56.64 44.7,56.64 45.72,55.63 45.72,41.15 46.74,40.13 46.99,40.13 v52.58,40.13 | U1.43 51.82,26.67 v52.58,27.43
  Bottom 0.254: v52.58,27.43 v52.58,40.13
SPEC2_GATED  (via drill 0.41)
  Top 0.254: R19.1 11.18,47.75 11.18,49.02 8.89,49.02 5.84,45.97 5.84,41.06 Q1.3 6.86,40.89 7.62,40.13 7.62,35.67 | U6.5 20.83,52.1 20.83,53.09 v20.07,53.85 | C12.1 7.62,35.67 | 7.62,35.67 9.65,35.67 U2.1 9.65,38.86 10.67,39.88 19.05,39.88 20.07,40.89 v20.07,44.96 20.07,46.88 R12.1
  Bottom 0.254: v20.07,53.85 v20.07,44.96
SPEC2_OUT  (via drill 0.41)
  Top 0.254: v36.83,33.53 36.32,33.02 36.32,16 37.59,14.73 47.55,14.73 48.51,15.69 48.51,19.05 U1.12
  Bottom 0.254: U2.3 14.73,34.8 16,33.53 v36.83,33.53
SPEC2_POWER  (via drill 0.41)
  Top 0.254: Q1.1 3.57,43.43 v3.56,43.43 | v21.84,37.85 33.53,37.85 34.8,36.58 34.8,12.19 36.07,10.92 52.07,10.92 52.83,11.68 52.83,18.34 U1.20
  Bottom 0.254: v3.56,43.43 3.56,39.12 4.83,37.85 v21.84,37.85
SPEC2_RESET  (via drill 0.41)
  Top 0.254: v22.61,39.62 34.04,39.62 35.56,38.1 35.56,14.99 36.58,13.97 48.26,13.97 49.28,14.99 49.28,16 50.8,17.53 50.8,18.34 U1.16
  Bottom 0.254: U2.7 12.19,40.64 13.21,39.62 v22.61,39.62
SPEC2_STROBE
  Top 0.254: U2.4 33.02,35.81 34.04,34.8 34.04,11.43 35.31,10.16 52.07,10.16 52.32,10.16 53.34,11.18 53.34,18.34 U1.21
SPEC_GATED  (via drill 0.41)
  Top 0.254: v22.61,7.37 21.59,6.35 C9.2 C23.2 | U3.1 20.32,30.73 C14.1 20.83,26.92 | U5.5 18.03,11.65 v18.03,11.68 | R10.1 v11.94,11.18 | v18.29,18.29 Q2.3 21.08,18.29 21.08,20.07 21.84,20.83 22.86,20.83 23.62,21.59 23.62,25.91 22.61,26.92 20.83,26.92 | R20.1 20.83,26.92
  Bottom 0.254: U8.2 22.61,7.27 v22.61,7.37 19.3,7.37 18.03,8.64 18.03,11.18 | 18.03,11.18 v18.03,11.68 18.03,18.29 v18.29,18.29 | v11.94,11.18 18.03,11.18
SPEC_OUT  (via drill 0.41)
  Top 0.254: v37.34,28.19 37.08,27.94 37.08,16.76 38.35,15.49 46.48,15.49 47.24,16.26 47.24,19.05 47.75,19.56 48.57,19.56 U1.11
  Bottom 0.254: U3.3 12.19,29.21 13.21,28.19 v37.34,28.19
SPEC_POWER
  Top 0.254: Q2.1 23.35,17.27 30.48,17.27 31.75,16 31.75,9.14 33.02,7.87 52.83,7.87 53.8,7.87 54.82,8.89 U1.24
SPEC_RESET  (via drill 0.41)
  Top 0.254: v24.89,24.89 31.24,24.89 32.51,23.62 32.51,9.91 33.78,8.64 53.09,8.64 53.3,8.64 54.32,9.65 U1.23
  Bottom 0.254: U3.7 14.73,23.88 15.75,24.89 v24.89,24.89
SPEC_STROBE  (via drill 0.41)
  Top 0.254: v24.89,26.92 32,26.92 33.27,25.65 33.27,10.67 34.54,9.4 51.31,9.4 52.8,9.4 53.82,10.41 U1.22
  Bottom 0.254: U3.4 9.65,27.94 10.67,26.92 v24.89,26.92
USB+  (via drill 0.41)
  Top 0.254: J1.11 30.23,60.96 30.23,58.93 32,57.15 32,54.36 33.02,53.34 41.4,53.34 42.42,52.32 42.42,37.34 43.43,36.32 v43.43,35.05 | v49.02,35.05 49.82,35.05 U1.47
  Bottom 0.254: v43.43,35.05 v49.02,35.05
USB-  (via drill 0.41)
  Top 0.254: J1.12 28.96,58.17 30.73,56.39 30.73,53.59 31.75,52.58 40.64,52.58 41.4,51.82 41.4,36.58 v42.16,35.81 | v50.04,35.81 50.32,35.81 U1.46
  Bottom 0.254: v42.16,35.81 v50.04,35.81

### Text on the board
tPlace: Audio / Spectrum / Analyzer | A | Mic / Port
tNames: Gain Adj. / 3x-133x / (6bB-42dB) / CCW-,CW+ | MIC Input | SAM4L Programmer | Joshua Adkins | 09/2016 | Gain Adj. / 3x-133x / (6bB-42dB) / CCW-,CW+